# EAGLE design M7050D (EAGLE 6.6.0)
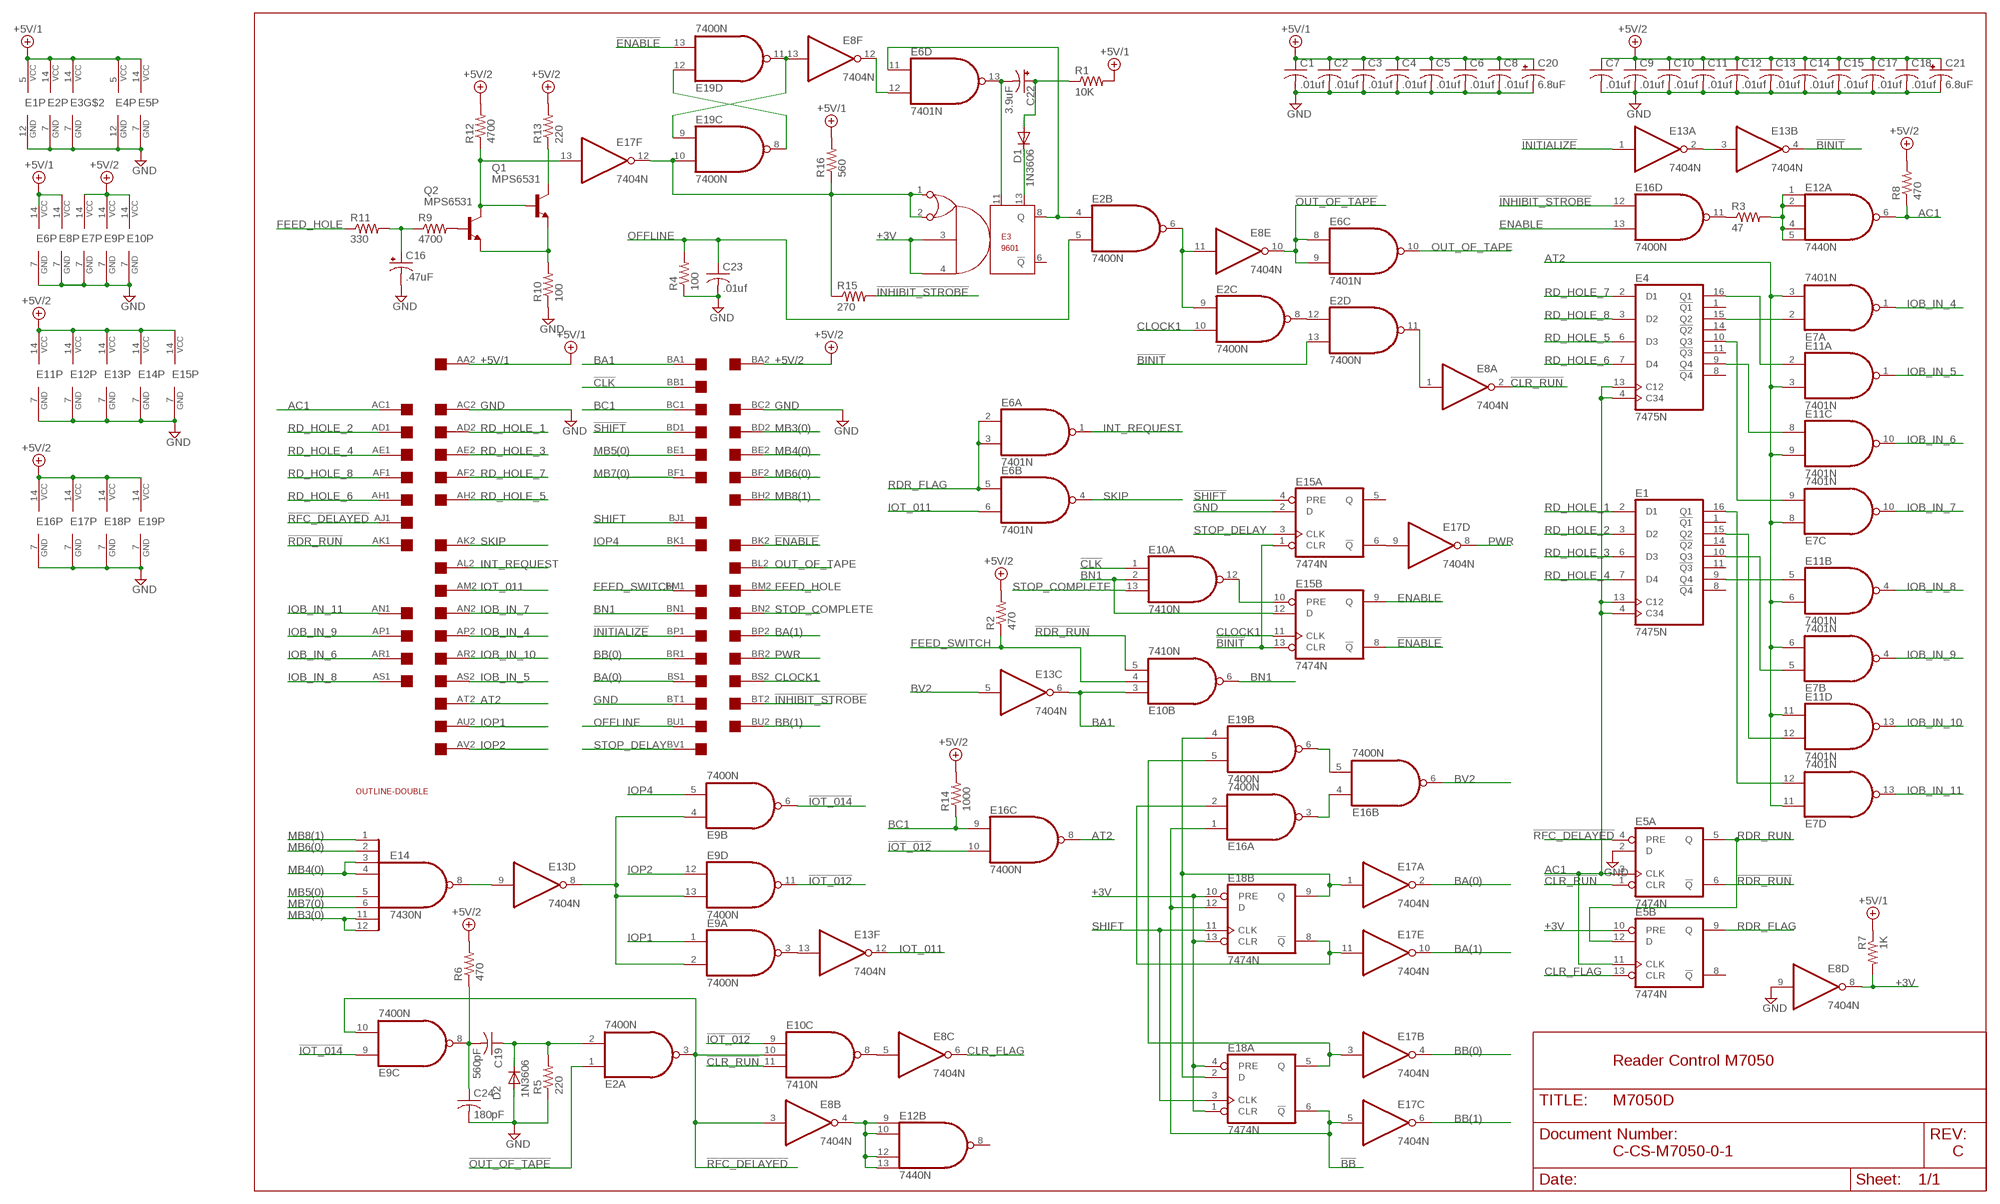
[diagram p0: schematic, sheet 1]

## Parts
C1  .01uf  C-US075-032X103  [C075-032X103]
C2  .01uf  C-US075-032X103  [C075-032X103]
C3  .01uf  C-US075-032X103  [C075-032X103]
C4  .01uf  C-US075-032X103  [C075-032X103]
C5  .01uf  C-US075-032X103  [C075-032X103]
C6  .01uf  C-US075-032X103  [C075-032X103]
C7  .01uf  C-US075-032X103  [C075-032X103]
C8  .01uf  C-US075-032X103  [C075-032X103]
C9  .01uf  C-US075-032X103  [C075-032X103]
C10  .01uf  C-US075-032X103  [C075-032X103]
C11  .01uf  C-US075-032X103  [C075-032X103]
C12  .01uf  C-US075-032X103  [C075-032X103]
C13  .01uf  C-US075-032X103  [C075-032X103]
C14  .01uf  C-US075-032X103  [C075-032X103]
C15  .01uf  C-US075-032X103  [C075-032X103]
C16  .47uF  CPOL-USE15-5AXIAL  [E15-5]
C17  .01uf  C-US075-032X103  [C075-032X103]
C18  .01uf  C-US075-032X103  [C075-032X103]
C19  560pF  C-US075-032X103  [C075-032X103]
C20  6.8uF  CPOL-USE20-8AXIAL  [E12-8]
C21  6.8uF  CPOL-USE20-8AXIAL  [E12-8]
C22  3.9uF  CPOL-USE15-5AXIAL  [E15-5]
C23  .01uf  C-US075-032X103  [C075-032X103]
C24  180pF  C-US075-032X103  [C075-032X103]
D1  1N3606  1N4148DO35-10  [DO35-10]
D2  1N3606  1N4148DO35-10  [DO35-10]
E1  7475N  [DIL16]
E2  7400N  [DIL14]
E3  9601  [DIL14]
E4  7475N  [DIL16]
E5  7474N  74S74N  [DIL14]
E6  7401N  74LS01N  [DIL14]
E7  7401N  74LS01N  [DIL14]
E8  7404N  [DIL14]
E9  7400N  [DIL14]
E10  7410N  [DIL14]
E11  7401N  74LS01N  [DIL14]
E12  7440N  74S20N  [DIL14]
E13  7404N  [DIL14]
E14  7430N  [DIL14]
E15  7474N  74S74N  [DIL14]
E16  7400N  [DIL14]
E17  7404N  [DIL14]
E18  7474N  74S74N  [DIL14]
E19  7400N  [DIL14]
Q1  MPS6531  2N2102  [TO5]
Q2  MPS6531  2N2102  [TO5]
R1  10K  R-US_0207/10  [0207/10]
R2  470  R-US_0207/10  [0207/10]
R3  47  R-US_0207/10  [0207/10]
R4  100  R-US_0207/10  [0207/10]
R5  220  R-US_0207/10  [0207/10]
R6  470  R-US_0207/10  [0207/10]
R7  1K  R-US_0207/10  [0207/10]
R8  470  R-US_0207/10  [0207/10]
R9  4700  R-US_0207/10  [0207/10]
R10  100  R-US_0207/10  [0207/10]
R11  330  R-US_0207/10  [0207/10]
R12  4700  R-US_0207/10  [0207/10]
R13  220  R-US_0207/10  [0207/10]
R14  1000  R-US_0207/10  [0207/10]
R15  270  R-US_0207/10  [0207/10]
R16  560  R-US_0207/10  [0207/10]
U$5  DOUBLE  [EDGE-CON4]
U$6  OUTLINE-DOUBLE  [DOUBLE]

## Nets
!BA: E16.2(A:I1) E17.11(E:I) E18.8(B:!Q)
!BB: E16.1(A:I0) E17.5(C:I) E18.6(A:!Q) E18.12(B:D)
!BINIT: E2.13(D:I1) E13.4(B:O) E15.1(A:CLR) E15.13(B:CLR)
!CLK: E10.1(A:I0) U$5.BB1
!CLR_RUN: E5.1(A:CLR) E8.2(A:O) E10.11(C:I2)
!ENABLE: E15.8(B:!Q) E19.13(D:I1) U$5.BK2
!INHIBIT_STROBE: E16.12(D:I0) R15.2 U$5.BT2
!INITIALIZE: E13.1(A:I) U$5.BP1
!IOT_011: E9.3(A:O) E13.13(F:I)
!IOT_012: E9.11(D:O) E10.9(C:I0) E16.10(C:I1)
!IOT_014: E9.6(B:O) E9.9(C:I0)
!OUT_OF_TAPE: E2.1(A:I0) E6.8(C:I0) E6.9(C:I1) E8.10(E:O)
!RDR_RUN: E5.6(A:!Q) E10.5(B:I2) U$5.AK1
!RFC_DELAYED: E2.3(A:O) E5.4(A:PRE) E8.3(B:I) E9.10(C:I1) E10.10(C:I1) U$5.AJ1
!SHIFT: E15.4(A:PRE) U$5.BD1
+3V: E3.3 E3.4 E5.10(B:PRE) E8.8(D:O) E18.1(A:CLR) E18.4(A:PRE) E18.10(B:PRE) E18.13(B:CLR) R7.2
+5V/1 [Supply]: C1.1 C2.1 C3.1 C4.1 C5.1 C6.1 C8.1 C20.+ E1.5(VCC) E2.14(P:VCC) E3.14(VCC) E4.5(VCC) E5.14(P:VCC) E6.14(P:VCC) E8.14(P:VCC) R1.2 R7.1 R16.2 U$5.AA2
+5V/2 [Supply]: C7.1 C9.1 C10.1 C11.1 C12.1 C13.1 C14.1 C15.1 C17.1 C18.1 C21.+ E7.14(P:VCC) E9.14(P:VCC) E10.14(P:VCC) E11.14(P:VCC) E12.14(P:VCC) E13.14(P:VCC) E14.14(VCC) E15.14(P:VCC) E16.14(P:VCC) E17.14(P:VCC) E18.14(P:VCC) E19.14(P:VCC) R2.2 R6.2 R8.2 R12.2 R13.2 R14.2 U$5.BA2
AC1: E1.4(C34) E1.13(C12) E4.4(C34) E4.13(C12) E5.3(A:CLK) E5.11(B:CLK) E12.6(A:O) R8.1 U$5.AC1
AT2: E7.3(A:I1) E7.6(B:I1) E7.8(C:I0) E7.11(D:I0) E11.3(A:I1) E11.6(B:I1) E11.9(C:I1) E11.11(D:I0) E16.8(C:O) U$5.AT2
BA: E17.1(A:I) E18.2(A:D) E18.9(B:Q) E19.4(B:I0)
BA1: E10.3(B:I0) E13.6(C:O) U$5.BA1
BA(0): E17.2(A:O) U$5.BS1
BA(1): E17.10(E:O) U$5.BP2
BB: E17.3(B:I) E18.5(A:Q) E19.5(B:I1)
BB(0): E17.4(B:O) U$5.BR1
BB(1): E17.6(C:O) U$5.BU2
BC1: E16.9(C:I0) R14.1 U$5.BC1
BN1: E10.2(A:I1) E10.6(B:O) E15.12(B:D) U$5.BN1
BV2: E13.5(C:I) E16.6(B:O)
CLOCK1: E2.10(C:I1) E15.11(B:CLK) U$5.BS2
CLR_FLAG: E5.13(B:CLR) E8.6(C:O)
ENABLE: E15.9(B:Q) E16.13(D:I1)
FEED_HOLE: R11.1 U$5.BM2
FEED_SWITCH: E10.4(B:I1) R2.1 U$5.BM1
GND [Supply]: C1.2 C2.2 C3.2 C4.2 C5.2 C6.2 C7.2 C8.2 C9.2 C10.2 C11.2 C12.2 C13.2 C14.2 C15.2 C16.- C17.2 C18.2 C20.- C21.- C23.2 C24.2 D2.A E1.12(GND) E2.7(P:GND) E3.7(GND) E4.12(GND) E5.2(A:D) E5.7(P:GND) E6.7(P:GND) E7.7(P:GND) E8.7(P:GND) E8.9(D:I) E9.7(P:GND) E10.7(P:GND) E11.7(P:GND) E12.7(P:GND) E13.7(P:GND) E14.7(GND) E15.2(A:D) E15.7(P:GND) E16.7(P:GND) E17.7(P:GND) E18.7(P:GND) E19.7(P:GND) R4.1 R5.1 R10.1 U$5.AC2 U$5.BC2 U$5.BT1
INT_REQUEST: E6.1(A:O) U$5.AL2
IOB_IN_4: E7.1(A:O) U$5.AP2
IOB_IN_5: E11.1(A:O) U$5.AS2
IOB_IN_6: E11.10(C:O) U$5.AR1
IOB_IN_7: E7.10(C:O) U$5.AN2
IOB_IN_8: E11.4(B:O) U$5.AS1
IOB_IN_9: E7.4(B:O) U$5.AP1
IOB_IN_10: E11.13(D:O) U$5.AR2
IOB_IN_11: E7.13(D:O) U$5.AN1
IOP1: E9.1(A:I0) U$5.AU2
IOP2: E9.12(D:I0) U$5.AV2
IOP4: E9.5(B:I1) U$5.BK1
IOT_011: E6.6(B:I1) E13.12(F:O) U$5.AM2
MB3(0): E14.11(I6) E14.12(I7) U$5.BD2
MB4(0): E14.3(I2) E14.4(I3) U$5.BE2
MB5(0): E14.5(I4) U$5.BE1
MB6(0): E14.2(I1) U$5.BF2
MB7(0): E14.6(I5) U$5.BF1
MB8(1): E14.1(I0) U$5.BH2
N$1: D1.C E3.13
N$2: E4.15(Q2) E7.2(A:I0)
N$3: E4.16(Q1) E11.2(A:I0)
N$4: C22.+ D1.A R1.1
N$5: E13.9(D:I) E14.8(O)
N$6: E2.11(D:O) E8.1(A:I)
N$8: E9.2(A:I1) E9.4(B:I0) E9.13(D:I1) E13.8(D:O)
N$9: E4.9(Q4) E11.8(C:I0)
N$10: E4.10(Q3) E7.9(C:I1)
N$11: E1.9(Q4) E11.5(B:I0)
N$12: E1.10(Q3) E7.5(B:I0)
N$13: E1.15(Q2) E11.12(D:I1)
N$14: E1.16(Q1) E7.12(D:I1)
N$16: E2.8(C:O) E2.12(D:I0)
N$17: E17.13(F:I) Q1.2(B) Q2.3(C) R12.1
N$18: Q1.3(C) R13.1
N$19: Q1.1(E) Q2.1(E) R10.2
N$20: Q2.2(B) R9.2
N$21: E3.1 E3.2 E17.12(F:O) E19.10(C:I1) R15.1 R16.1
N$22: C16.+ R9.1 R11.2
N$24: E16.5(B:I1) E19.6(B:O)
N$25: E16.3(A:O) E16.4(B:I0)
N$26: E16.11(D:O) R3.1
N$27: E15.6(A:!Q) E17.9(D:I)
N$28: E10.12(A:O) E15.10(B:PRE)
N$29: C19.2 C24.1 E9.8(C:O) R6.1
N$30: C19.1 D2.C E2.2(A:I1) R5.2
N$32: E13.2(A:O) E13.3(B:I)
N$33: E8.5(C:I) E10.8(C:O)
N$34: E2.4(B:I0) E3.8(Q) E6.11(D:I0)
N$35: E2.6(B:O) E2.9(C:I0) E8.11(E:I)
N$36: E8.4(B:O) E12.9(B:I0) E12.10(B:I1) E12.12(B:I2) E12.13(B:I3)
N$37: C22.- E3.11 E6.13(D:O)
N$38: E6.12(D:I1) E8.12(F:O)
N$39: E12.1(A:I0) E12.2(A:I1) E12.4(A:I2) E12.5(A:I3) R3.2
N$40: E8.13(F:I) E19.9(C:I0) E19.11(D:O)
N$41: E19.8(C:O) E19.12(D:I0)
OFFLINE: C23.1 E2.5(B:I1) R4.2 U$5.BU1
OUT_OF_TAPE: E6.10(C:O) U$5.BL2
PWR: E17.8(D:O) U$5.BR2
RD_HOLE_1: E1.2(D1) U$5.AD2
RD_HOLE_2: E1.3(D2) U$5.AD1
RD_HOLE_3: E1.6(D3) U$5.AE2
RD_HOLE_4: E1.7(D4) U$5.AE1
RD_HOLE_5: E4.6(D3) U$5.AH2
RD_HOLE_6: E4.7(D4) U$5.AH1
RD_HOLE_7: E4.2(D1) U$5.AF2
RD_HOLE_8: E4.3(D2) U$5.AF1
RDR_FLAG: E5.9(B:Q) E6.2(A:I0) E6.3(A:I1) E6.5(B:I0)
RDR_RUN: E5.5(A:Q) E5.12(B:D)
SHIFT: E18.3(A:CLK) E18.11(B:CLK) U$5.BJ1
SKIP: E6.4(B:O) U$5.AK2
STOP_COMPLETE: E10.13(A:I2) U$5.BN2
STOP_DELAY: E15.3(A:CLK) U$5.BV1
Unconnected: E1.1(!Q1) E1.8(!Q4) E1.11(!Q3) E1.14(!Q2) E3.6(!Q) E4.1(!Q1) E4.8(!Q4) E4.11(!Q3) E4.14(!Q2) E5.8(B:!Q) E12.8(B:O) E13.10(E:O) E13.11(E:I) E15.5(A:Q) E19.1(A:I0) E19.2(A:I1) E19.3(A:O) U$5.AA1 U$5.AB1 U$5.AB2 U$5.AJ2 U$5.AL1 U$5.AM1 U$5.AT1 U$5.AU1 U$5.AV1 U$5.BB2 U$5.BH1 U$5.BJ2 U$5.BL1 U$5.BV2

## Notes on the sheet
- Reader Control M7050
- C-CS-M7050-0-1 | C

## Library data of the parts
C1-C15 C17-C19 C23 C24 = rcl:C-US: CAPACITOR, American symbol
C16 C22 = dec-con:CPOL-USE15-5AXIAL: 0.5" veresion of an electrolytic
C20 C21 = dec-con:CPOL-USE20-8AXIAL: A 0.8 inch electrolytic.
D1 D2 = diode:1N4148: DIODE high speed (Philips)
E1 E4 = 74xx-us:74*75: 4-bit bistable LATCH
E2 E9 E16 E19 = 74xx-us:74*00: Quad 2-input NAND gate
E3 = dec-con:9601: DEC9601 monstable
E5 E15 E18 = 74xx-us:74*74: Dual D type positive edge triggered FLIP FLOP, preset and clear
E6 E7 E11 = 74xx-us:74*01: Quad 2-input NAND gate, open collector
E8 E13 E17 = 74xx-us:74*04: Hex INVERTER
E10 = 74xx-us:74*10: Triple 3-input NAND gate
E12 = 74xx-us:74*20: Dual 4-input NAND gate
E14 = 74xx-us:74*30: 8-input NAND gate
Q1 Q2 = transistor-npn:2N2102: NPN Transistor
R1-R16 = rcl:R-US_: RESISTOR, American symbol
U$5 = dec-con:DOUBLE: Double-Height DEC board
U$6 = dec-con:OUTLINE-*: Board outlines for DEC boards.

## Net classes
1 Supply: width 0.813 mm

## Board
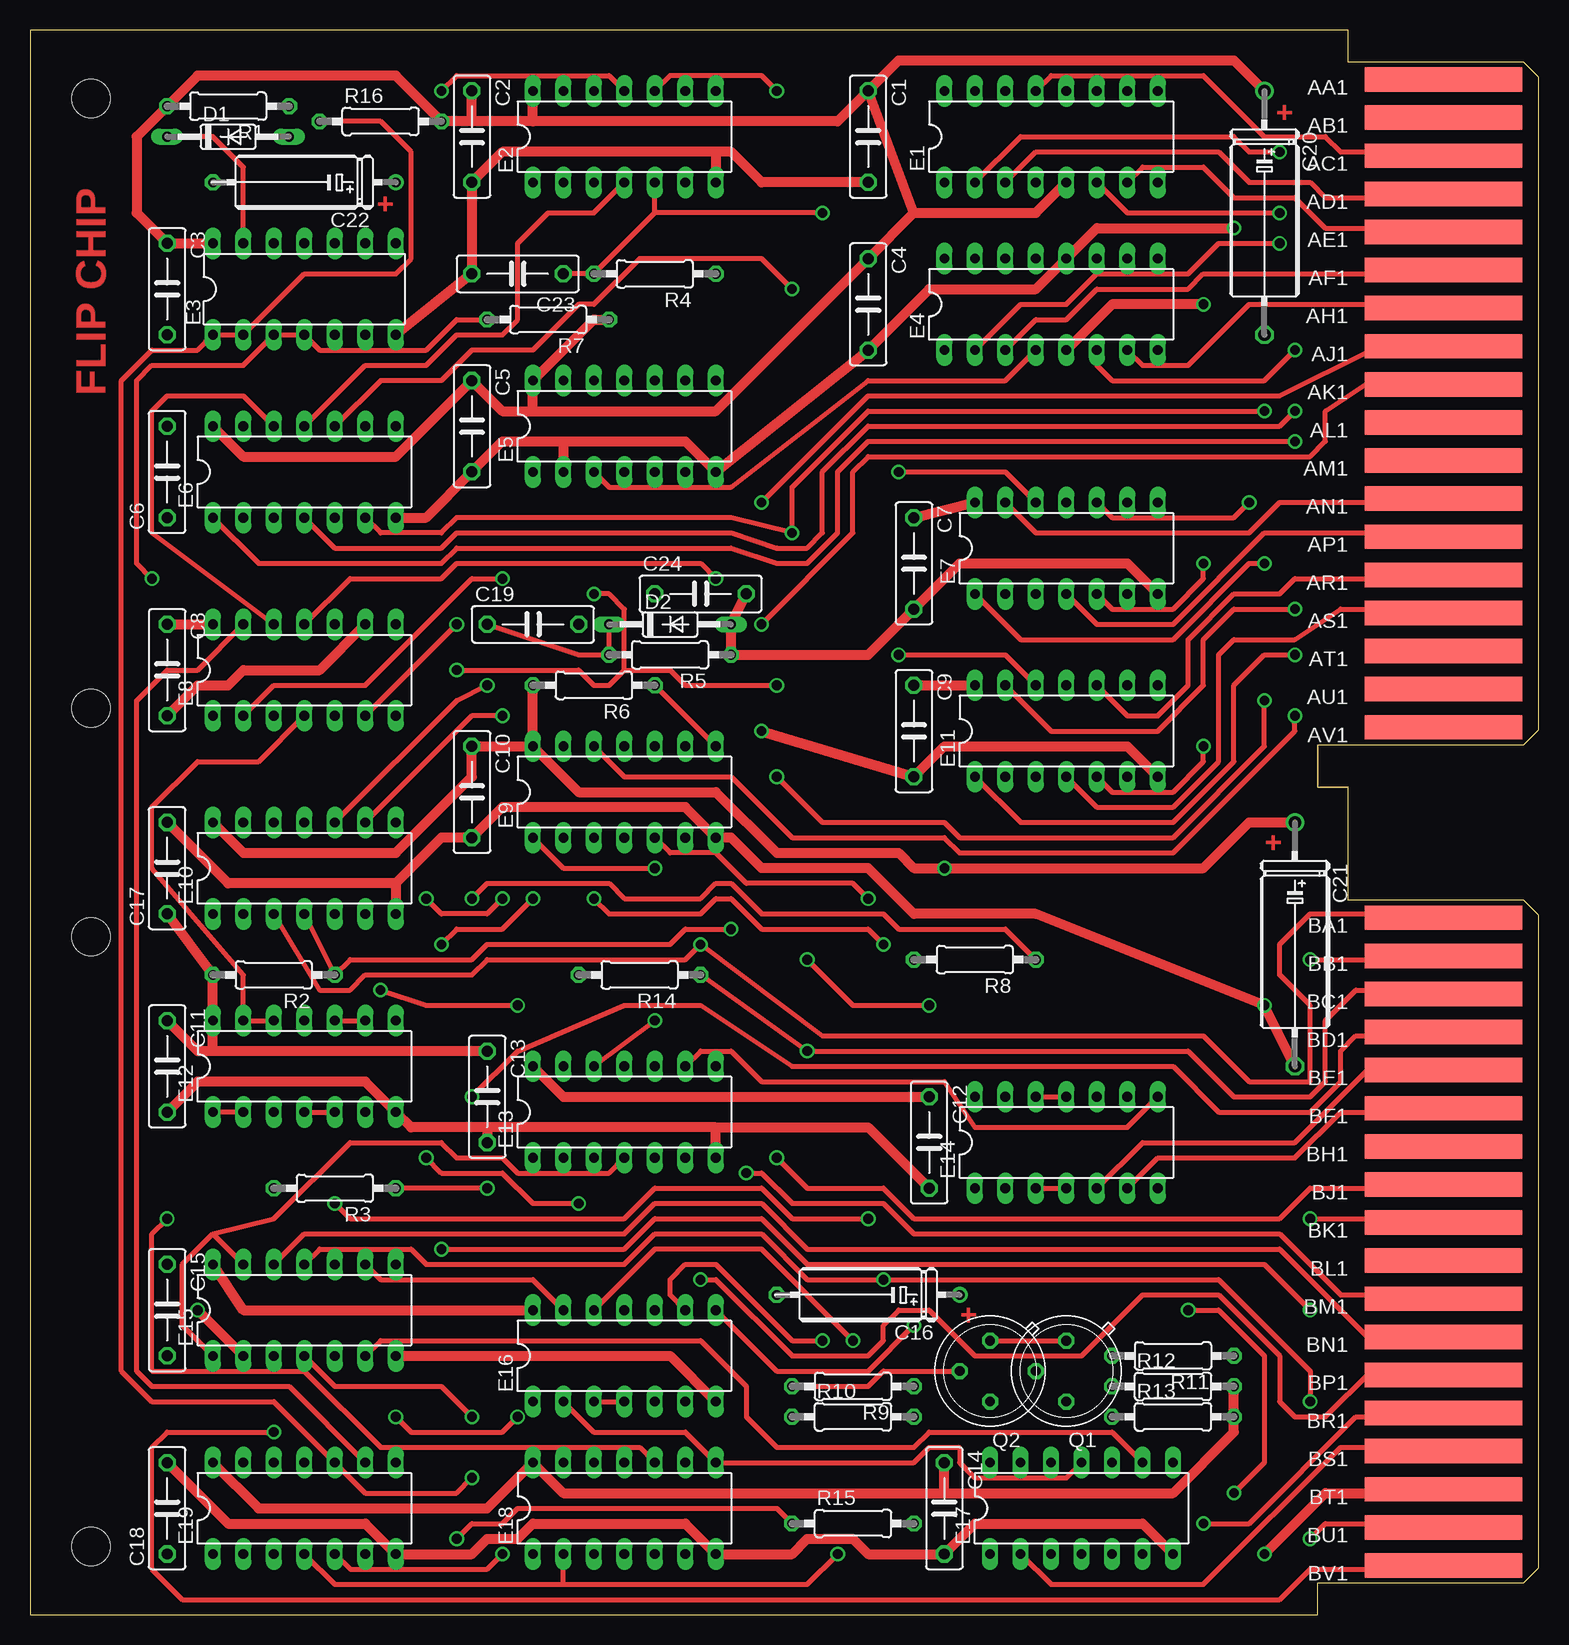
[diagram p1: board, top side]
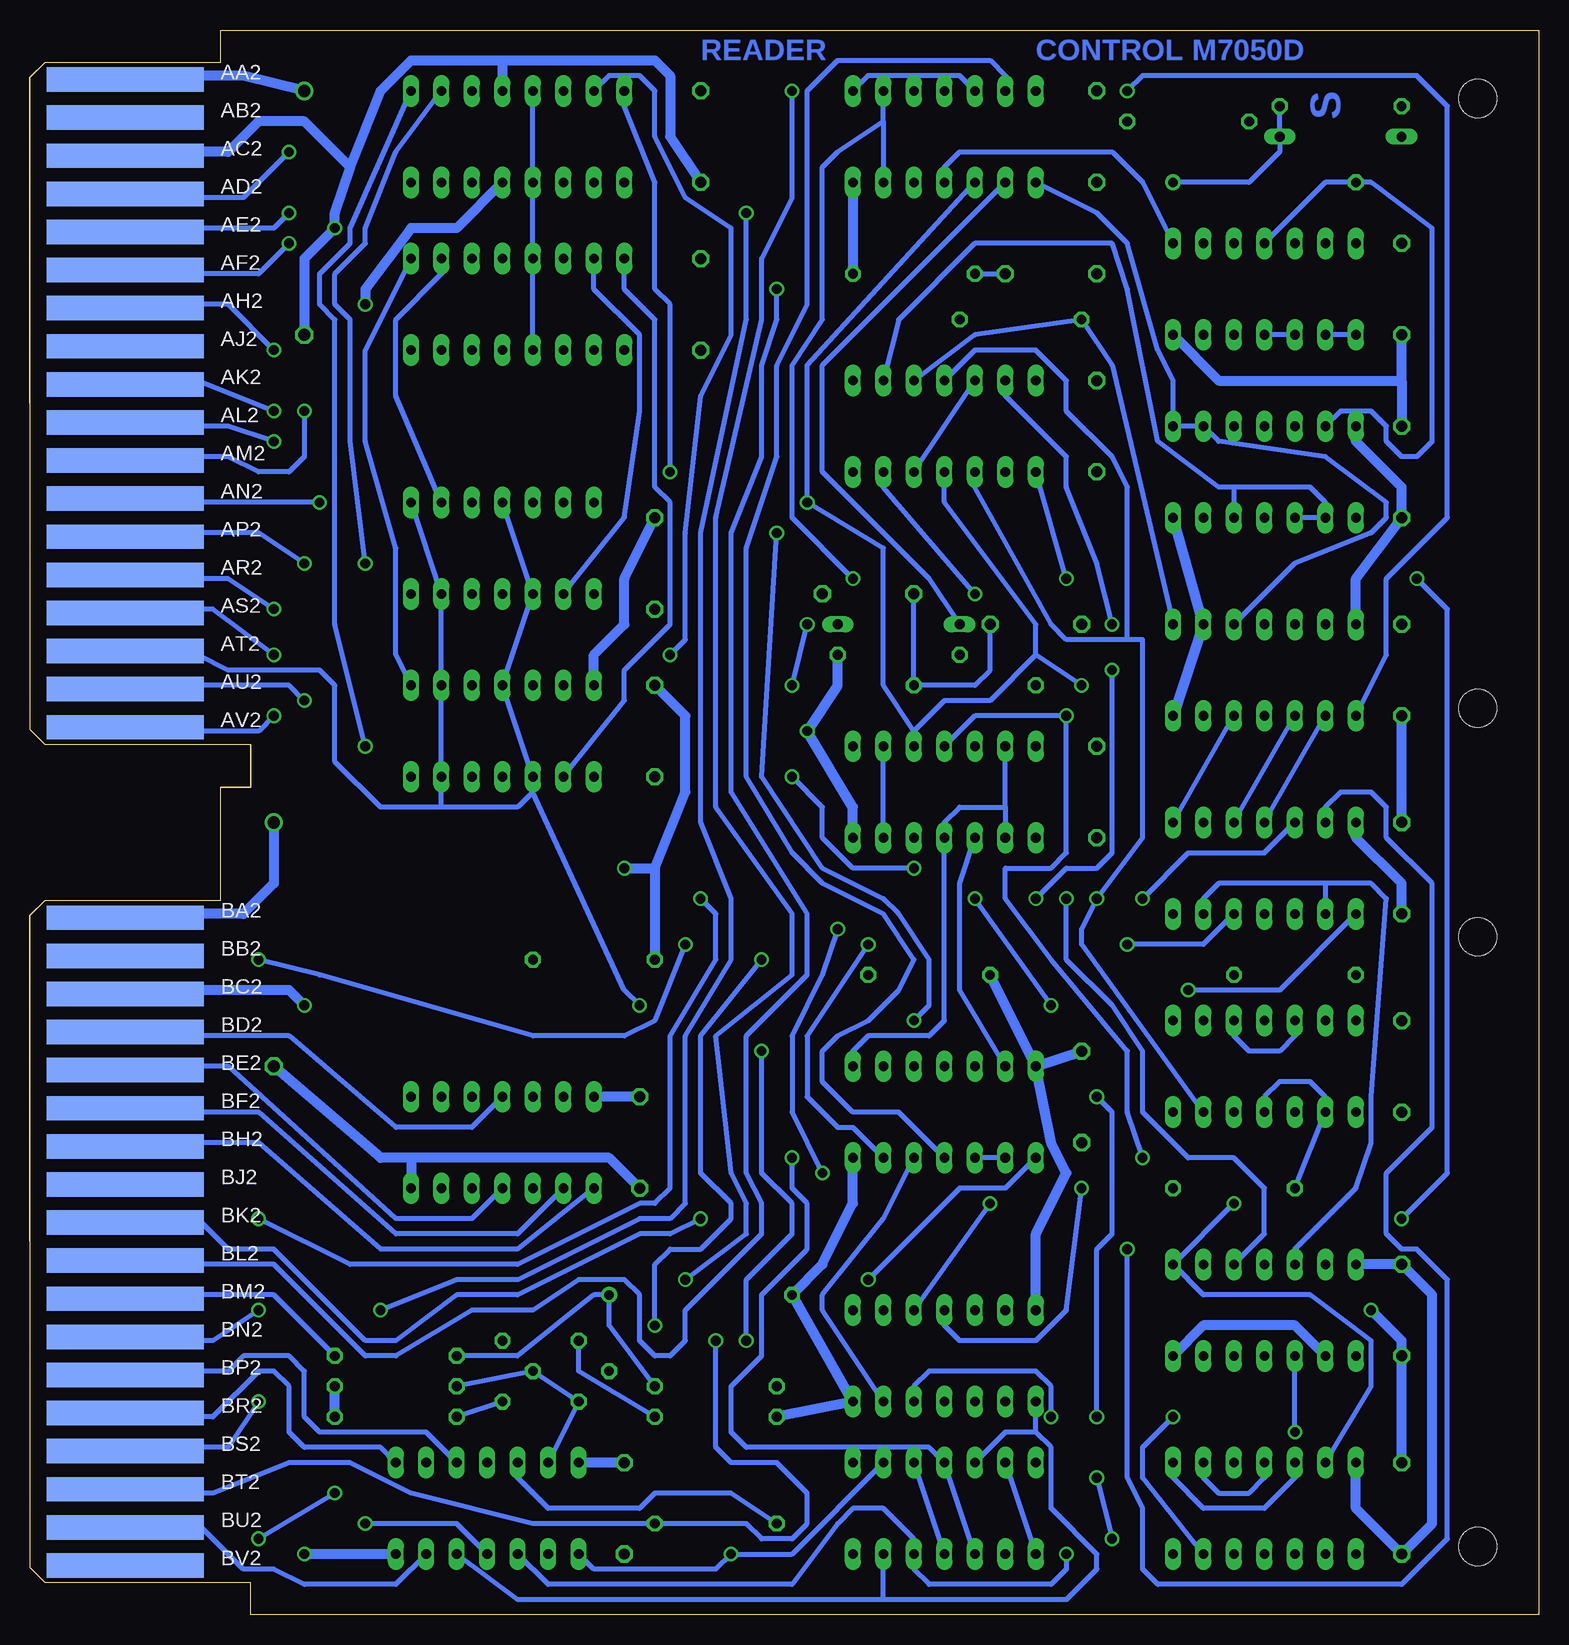
[diagram p2: board, bottom side, seen from below]

Size 125.73 x 132.08 mm. Coordinates in mm from the lower left corner, seen from the top.
Copper layers (1+16): Top 0.035mm / dielectric 1.5mm / Bottom 0.035mm
Design rules "16mils": minimum track width 16mil, minimum drill 32mil, track to track 15mil, track to pad 10mil, pad to pad 10mil, via to via 10mil, smd to smd 10mil, copper to edge 13mil, drill to drill 10mil, minimum pad ring 10mil, minimum via ring 8mil, stop-mask expansion 0mil, vias tented up to drill 0mil, thermal gap 10mil

### Footprints (pad centres in the part's own frame; a part is rotated, then mirrored left to right if it is on the bottom)
C075-032X103 = drill 0.914 octagon: 1 -3.81,0; 2 3.81,0
E15-5 = drill 0.813: + -7.62,0 | drill 0.813 octagon: - 7.62,0
E12-8 = drill 1.016: + -10.16,0 | drill 1.016 octagon: - 10.16,0
DO35-10 = drill 0.813 long: A 5.08,0; C -5.08,0
DIL16 = drill 0.813 long: 1 -8.89,-3.81; 2 -6.35,-3.81; 3 -3.81,-3.81; 4 -1.27,-3.81; 5 1.27,-3.81; 6 3.81,-3.81; 7 6.35,-3.81; 8 8.89,-3.81; 9 8.89,3.81; 10 6.35,3.81; 11 3.81,3.81; 12 1.27,3.81; 13 -1.27,3.81; 14 -3.81,3.81; 15 -6.35,3.81; 16 -8.89,3.81
DIL14 = drill 0.813 long: 1 -7.62,-3.81; 2 -5.08,-3.81; 3 -2.54,-3.81; 4 0,-3.81; 5 2.54,-3.81; 6 5.08,-3.81; 7 7.62,-3.81; 8 7.62,3.81; 9 5.08,3.81; 10 2.54,3.81; 11 0,3.81; 12 -2.54,3.81; 13 -5.08,3.81; 14 -7.62,3.81
TO5 = drill 0.813 octagon: 1 0,-2.54; 2 2.54,0; 3 0,2.54
0207/10 = drill 0.813 octagon: 1 -5.08,0; 2 5.08,0
EDGE-CON4 = smd 13.106 x 2.032: AA1 7.938,4.128; AB1 7.938,7.303; AC1 7.938,10.477; AD1 7.938,13.652; AE1 7.938,16.828; AF1 7.938,20.003; AH1 7.938,23.177; AJ1 7.938,26.352; AK1 7.938,29.527; AL1 7.938,32.703; AM1 7.938,35.877; AN1 7.938,39.053; AP1 7.938,42.227; AR1 7.938,45.403; AS1 7.938,48.578; AT1 7.938,51.752; AU1 7.938,54.928; AV1 7.938,58.102; BA1 7.938,73.978; BB1 7.938,77.153; BC1 7.938,80.328; BD1 7.938,83.502; BE1 7.938,86.677; BF1 7.938,89.853; BH1 7.938,93.028; BJ1 7.938,96.203; BK1 7.938,99.377; BL1 7.938,102.552; BM1 7.938,105.728; BN1 7.938,108.903; BP1 7.938,112.078; BR1 7.938,115.252; BS1 7.938,118.427; BT1 7.938,121.603; BU1 7.938,124.778; BV1 7.938,127.953 | smd 13.106 x 2.032 bottom: AA2 7.938,4.128; AB2 7.938,7.303; AC2 7.938,10.477; AD2 7.938,13.652; AE2 7.938,16.828; AF2 7.938,20.003; AH2 7.938,23.177; AJ2 7.938,26.352; AK2 7.938,29.527; AL2 7.938,32.703; AM2 7.938,35.877; AN2 7.938,39.053; AP2 7.938,42.227; AR2 7.938,45.403; AS2 7.938,48.578; AT2 7.938,51.752; AU2 7.938,54.928; AV2 7.938,58.102; BA2 7.938,73.978; BB2 7.938,77.153; BC2 7.938,80.328; BD2 7.938,83.502; BE2 7.938,86.677; BF2 7.938,89.853; BH2 7.938,93.028; BJ2 7.938,96.203; BK2 7.938,99.377; BL2 7.938,102.552; BM2 7.938,105.728; BN2 7.938,108.903; BP2 7.938,112.078; BR2 7.938,115.252; BS2 7.938,118.427; BT2 7.938,121.603; BU2 7.938,124.778; BV2 7.938,127.953
DOUBLE = hole 3.175: 120.65,56.515; 120.65,5.715; 120.65,75.565; 120.65,126.365

### Placement (x,y rotation side)
C1  69.85,123.19 270 top
C2  36.83,123.19 270 top
C3  11.43,110.49 270 top
C4  69.85,109.22 270 top
C5  36.83,99.06 270 top
C6  11.43,95.25 90 top
C7  73.66,87.63 270 top
C8  11.43,78.74 270 top
C9  73.66,73.66 270 top
C10  36.83,68.58 270 top
C11  11.43,45.72 270 top
C12  74.93,39.37 270 top
C13  38.1,43.18 270 top
C14  76.2,8.89 270 top
C15  11.43,25.4 270 top
C16  69.85,26.67 180 top
C17  11.43,62.23 90 top
C18  11.43,8.89 90 top
C19  41.91,82.55 0 top
C20  102.87,116.84 270 top
C21  105.41,55.88 270 top
C22  22.86,119.38 180 top
C23  40.64,111.76 180 top
C24  55.88,85.09 0 top
D1  16.51,123.19 0 top
D2  53.34,82.55 0 top
E1  85.09,123.19 0 top
E2  49.53,123.19 0 top
E3  22.86,110.49 0 top
E4  85.09,109.22 0 top
E5  49.53,99.06 0 top
E6  22.86,95.25 0 top
E7  86.36,88.9 0 top
E8  22.86,78.74 0 top
E9  49.53,68.58 0 top
E10  22.86,62.23 0 top
E11  86.36,73.66 0 top
E12  22.86,45.72 0 top
E13  49.53,41.91 0 top
E14  86.36,39.37 0 top
E15  22.86,25.4 0 top
E16  49.53,21.59 0 top
E17  87.63,8.89 0 top
E18  49.53,8.89 0 top
E19  22.86,8.89 0 top
Q1  86.36,20.32 180 top
Q2  80.01,20.32 180 top
R1  16.51,125.73 180 top
R2  20.32,53.34 180 top
R3  25.4,35.56 180 top
R4  52.07,111.76 180 top
R5  53.34,80.01 180 top
R6  46.99,77.47 180 top
R7  43.18,107.95 180 top
R8  78.74,54.61 180 top
R9  68.58,19.05 180 top
R10  68.58,16.51 0 top
R11  95.25,21.59 180 top
R12  95.25,19.05 0 top
R13  95.25,16.51 0 top
R14  50.8,53.34 180 top
R15  68.58,7.62 0 top
R16  29.21,124.46 0 top
U$3  [FLIPCHIP]  1.27,82.55 0 top
U$5  125.73,132.08 180 top
U$6  125.73,132.08 180 top

### Tracks (layer width: path | path; a pad name or v marks a point on that pad's centre or on a via)
!BA
  Top 0.406: E17.11 86.36,11.43 78.74,11.43 77.47,12.7 77.47,13.97 74.93,13.97 73.66,12.7 E18.8 54.61,15.24 46.99,15.24 E16.2
!BB
  Bottom 0.406: E17.5 85.09,1.27 54.61,1.27 | 54.61,1.27 E18.6 | 41.91,15.24 E16.1 | 41.91,15.24 40.64,13.97 40.64,8.89 36.83,5.08 36.83,3.81 39.37,1.27 54.61,1.27 | E18.12 44.45,15.24 41.91,15.24
!BINIT
  Top 0.406: E15.1 12.7,24.13 12.7,29.21 15.24,31.75 | 15.24,31.75 E15.13 | E13.4 48.26,36.83 40.64,36.83 39.37,38.1 35.56,38.1 34.29,39.37 26.67,39.37 20.32,33.02 15.24,31.75
  Bottom 0.406: E2.13 44.45,128.27 45.72,129.54 58.42,129.54 60.96,127 60.96,109.22 63.5,104.14 63.5,96.52 66.04,88.9 66.04,69.85 62.23,63.5 59.69,60.96 54.61,58.42 52.07,54.61 53.34,52.07 55.88,49.53 58.42,48.26 59.69,46.99 59.69,44.45 57.15,41.91 53.34,41.91 E13.4
!CLK  (via drill 0.81)
  Top 0.406: U$5.BB1 116.84,54.61 v106.68,54.61 | v71.12,55.88 69.85,57.15 60.96,57.15 58.42,59.69 57.15,59.69 55.88,58.42 48.26,58.42 v46.99,59.69 | v40.64,50.8 33.02,50.8 v29.21,52.07
  Bottom 0.406: E10.1 21.59,52.07 v29.21,52.07 | v106.68,54.61 101.6,53.34 83.82,48.26 76.2,48.26 73.66,49.53 v71.12,55.88 | v40.64,50.8 v46.99,59.69
!CLR_RUN  (via drill 0.81)
  Top 0.406: v39.37,86.36 36.83,86.36 27.94,77.47 20.32,77.47 E8.2
  Bottom 0.406: E10.11 E8.2 | v39.37,86.36 E5.1
!ENABLE  (via drill 0.81)
  Top 0.406: v25.4,34.29 26.67,33.02 49.53,33.02 52.07,35.56 60.96,35.56 63.5,33.02 v69.85,33.02
  Bottom 0.406: v25.4,34.29 E15.8 27.94,26.67 19.05,26.67 13.97,22.86 13.97,19.05 E19.13 | v69.85,33.02 72.39,31.75 74.93,31.75 85.09,26.67 90.17,26.67 95.25,22.86 97.79,22.86 105.41,30.48 109.22,30.48 111.76,33.02 116.84,33.02 U$5.BK2
!INHIBIT_STROBE  (via drill 0.81)
  Top 0.406: E16.12 52.07,30.48 60.96,30.48 v68.58,22.86
  Bottom 0.406: U$5.BT2 116.84,10.16 110.49,10.16 104.14,12.7 99.06,12.7 93.98,10.16 83.82,7.62 R15.2 66.04,7.62 64.77,6.35 62.23,6.35 60.96,7.62 60.96,10.16 63.5,12.7 67.31,12.7 68.58,13.97 v68.58,22.86
!INITIALIZE  (via drill 0.81)
  Top 0.406: v55.88,27.94 57.15,27.94 63.5,21.59 69.85,21.59 71.12,22.86 71.12,24.13 72.39,25.4 74.93,25.4 78.74,21.59 87.63,21.59 92.71,26.67 99.06,26.67 104.14,21.59 104.14,17.78 105.41,16.51 107.95,16.51 111.76,20.32 116.84,20.32 U$5.BP1
  Bottom 0.406: E13.1 44.45,35.56 48.26,35.56 v55.88,27.94
!IOT_011
  Bottom 0.406: E13.13 48.26,52.07 48.26,60.96 E9.3
!IOT_012  (via drill 0.81)
  Top 0.406: v45.72,34.29 41.91,34.29 39.37,36.83 34.29,36.83 v33.02,38.1 | E10.9 36.83,74.93 v39.37,74.93
  Bottom 0.406: v45.72,34.29 E16.10 | v33.02,38.1 34.29,41.91 34.29,46.99 40.64,54.61 44.45,59.69 44.45,62.23 40.64,62.23 39.37,63.5 v39.37,74.93 46.99,74.93 E9.11
!IOT_014
  Bottom 0.406: E9.6 E9.9
!OUT_OF_TAPE
  Bottom 0.406: E8.10 20.32,87.63 13.97,90.17 12.7,91.44 12.7,92.71 17.78,96.52 26.67,97.79 E6.9 E6.8 30.48,102.87 31.75,105.41 34.29,114.3 36.83,116.84 E2.1
!RDR_RUN  (via drill 0.81)
  Top 0.406: U$5.AK1 116.84,102.87 111.76,102.87 107.95,100.33 107.95,97.79 106.68,96.52 69.85,96.52 68.58,95.25 68.58,90.17 v60.96,82.55 | v34.29,55.88 35.56,57.15 39.37,57.15 v41.91,59.69 | v46.99,85.09 48.26,85.09 49.53,83.82 49.53,78.74 | 49.53,78.74 48.26,77.47 46.99,77.47 45.72,78.74 v35.56,78.74 | 49.53,78.74 53.34,78.74 54.61,77.47 v62.23,77.47
  Bottom 0.406: v62.23,77.47 v60.96,82.55 | E10.5 27.94,55.88 v34.29,55.88 | E5.6 54.61,93.98 v46.99,85.09 | v41.91,59.69 39.37,62.23 36.83,62.23 35.56,63.5 v35.56,78.74
!RFC_DELAYED  (via drill 0.81)
  Top 0.406: U$5.AJ1 116.84,105.41 111.76,105.41 104.14,101.6 69.85,101.6 v60.96,92.71 | E10.10 35.56,76.2 v38.1,77.47
  Bottom 0.406: E10.10 E8.3 | 52.07,73.66 E9.10 | 52.07,73.66 54.61,77.47 54.61,88.9 v60.96,92.71 60.96,104.14 E2.3 | E5.4 49.53,92.71 41.91,82.55 41.91,80.01 | v38.1,77.47 41.91,80.01 | 41.91,80.01 45.72,76.2 49.53,76.2 52.07,73.66
!SHIFT  (via drill 0.81)
  Top 0.406: U$5.BD1 117.14,48.56 116.84,48.26 110.49,48.26 109.22,46.99 109.22,44.45 106.68,41.91 99.06,41.91 95.25,45.72 63.5,45.72 55.88,50.8 49.53,50.8 40.64,46.99 v36.83,43.18 | E15.4 25.4,19.05 34.29,19.05 v36.83,16.51
  Bottom 0.406: v36.83,43.18 35.56,41.91 35.56,31.75 36.83,30.48 v36.83,16.51
+3V  (via drill 0.81)
  Top 0.406: R7.2 35.56,107.95 33.02,105.41 24.13,105.41 E3.4 E3.3 17.78,104.14 10.16,104.14 8.89,102.87 8.89,87.63 v10.16,86.36 | E18.10 50.8,13.97 44.45,13.97 | 44.45,13.97 E18.13 | 44.45,13.97 29.21,13.97 22.86,20.32 10.16,20.32 10.16,31.75 v11.43,33.02
  Bottom 0.406: E18.10 E18.4 | E18.13 E18.1 | E8.8 35.56,104.14 R7.2 46.99,106.68 E5.10 | E3.3 E3.4 | v11.43,33.02 7.62,36.83 7.62,83.82 v10.16,86.36
+5V/1  (via drill 0.81)
  Top 0.813: 36.83,124.46 R16.2 30.48,128.27 13.97,128.27 R1.2 8.89,123.19 8.89,116.84 C3.1 E3.14 | 36.83,124.46 C2.1 | C1.1 67.31,124.46 41.91,124.46 | 41.91,124.46 36.83,124.46 | 73.66,116.84 C4.1 57.15,100.33 41.91,100.33 | 73.66,116.84 C1.1 | 73.66,116.84 83.82,116.84 E1.5 | 41.91,124.46 E2.14 | C20.+ 100.33,129.54 72.39,129.54 C1.1 | 41.91,100.33 39.37,100.33 C5.1 30.48,96.52 17.78,96.52 E6.14 | R7.1 46.99,107.95 E5.14 41.91,100.33 | E4.5 90.17,109.22 v97.79,109.22 | C8.1 E8.14
  Bottom 0.813: E6.14 15.24,97.79 11.43,93.98 C6.1 15.24,86.36 E8.14 | U$5.AA2 117.24,127.87 116.84,128.27 107.95,128.27 C20.+ | E1.5 90.17,115.57 93.98,115.57 97.79,110.49 v97.79,109.22
+5V/2  (via drill 0.81)
  Top 0.813: E19.14 19.05,8.89 38.1,8.89 E18.14 44.45,10.16 76.2,10.16 | E16.14 17.78,25.4 E15.14 | R12.2 R13.2 100.33,15.24 95.25,10.16 76.2,10.16 | 76.2,10.16 C14.1 | C17.1 R2.2 E12.14 15.24,46.99 | C11.1 13.97,46.99 15.24,46.99 | C13.1 15.24,46.99 | C21.+ 101.6,66.04 97.79,62.23 v76.2,62.23 73.66,62.23 72.39,63.5 62.23,63.5 57.15,68.58 45.72,68.58 E9.14 | C9.1 E11.14 | E9.14 R6.2 | E9.14 C10.1 36.83,69.85 30.48,63.5 17.78,63.5 E10.14 | C7.1 E7.14 | C12.1 44.45,43.18 E13.14
  Bottom 0.813: E19.14 15.24,8.89 C18.1 8.89,7.62 8.89,26.67 C15.1 E15.14 | U$5.BA2 117.24,58.02 116.84,58.42 107.95,58.42 105.41,60.96 C21.+ | C12.1 E14.14 | R13.2 R12.2 | E13.14 C13.1 | E13.14 R14.2 | E13.14 40.64,39.37 39.37,36.83 41.91,31.75 E16.14 | C14.1 E17.14 | v76.2,62.23 73.66,62.23 | 73.66,62.23 R8.2 | C9.1 71.12,74.93 71.12,68.58 73.66,62.23 | C17.1 11.43,60.96 15.24,64.77 E10.14 | C7.1 76.2,86.36 76.2,82.55 78.74,80.01 E11.14
AC1  (via drill 0.81)
  Top 0.406: R8.1 81.28,57.15 72.39,57.15 71.12,58.42 60.96,58.42 58.42,60.96 57.15,60.96 55.88,59.69 49.53,59.69 48.26,60.96 38.1,60.96 v36.83,59.69 | E4.4 81.28,102.87 69.85,102.87 58.42,93.98 48.26,93.98 E5.3 | U$5.AC1 116.84,121.92 109.22,121.92 107.95,123.19 102.87,123.19 97.79,128.27 85.09,128.27 E1.13
  Bottom 0.406: E12.6 38.1,55.88 38.1,57.15 v36.83,59.69 33.02,64.77 33.02,81.28 34.29,81.28 | 34.29,81.28 39.37,81.28 40.64,82.55 46.99,93.98 E5.3 | E4.4 E4.13 E1.4 E1.13 | E5.11 46.99,105.41 41.91,105.41 39.37,102.87 39.37,100.33 35.56,96.52 34.29,93.98 34.29,81.28
AT2  (via drill 0.81)
  Top 0.406: v74.93,50.8 68.58,50.8 v64.77,54.61 | E16.8 62.23,20.32 69.85,20.32 v73.66,24.13
  Bottom 0.406: 83.82,68.58 E11.3 E11.11 E7.3 E7.11 | 83.82,68.58 85.09,67.31 91.44,67.31 | 91.44,67.31 E11.6 E11.9 E7.6 E7.8 | 91.44,67.31 96.52,67.31 100.33,71.12 100.33,77.47 101.6,78.74 109.22,78.74 111.76,80.01 116.84,80.01 U$5.AT2 | 83.82,68.58 76.2,52.07 v74.93,50.8 | v64.77,54.61 69.85,48.26 69.85,36.83 67.31,34.29 67.31,33.02 69.85,30.48 72.39,30.48 73.66,29.21 v73.66,24.13
BA  (via drill 0.81)
  Top 0.406: E19.4 25.4,2.54 44.45,2.54 | 44.45,2.54 64.77,2.54 v67.31,5.08 | 44.45,2.54 E18.2
  Bottom 0.406: E17.1 78.74,3.81 68.58,3.81 v67.31,5.08 62.23,5.08 E18.9
BA1  (via drill 0.81)
  Top 0.406: E10.3 24.13,52.07 26.67,52.07 27.94,53.34 36.83,53.34 38.1,54.61 54.61,54.61 v55.88,55.88 66.04,48.26 97.79,48.26 101.6,44.45 106.68,44.45 106.68,50.8 104.14,53.34 104.14,55.88 106.68,58.42 116.84,58.42 U$5.BA1
  Bottom 0.406: E13.6 57.15,40.64 58.42,40.64 60.96,43.18 60.96,48.26 v55.88,55.88
BA(0)
  Top 0.406: U$5.BS1 116.84,13.97 109.22,13.97 97.79,2.54 85.09,2.54 E17.2
BA(1)
  Bottom 0.406: U$5.BP2 116.84,20.32 109.22,20.32 107.95,21.59 104.14,21.59 102.87,20.32 102.87,16.51 101.6,15.24 92.71,15.24 E17.10
BB  (via drill 0.81)
  Top 0.406: E19.5 26.67,3.81 38.1,3.81 v39.37,5.08
  Bottom 0.406: E17.3 82.55,2.54 62.23,2.54 58.42,7.62 57.15,8.89 54.61,8.89 52.07,6.35 E18.5 52.07,3.81 50.8,2.54 40.64,2.54 39.37,3.81 v39.37,5.08
BB(0)  (via drill 0.81)
  Top 0.406: U$5.BR1 116.84,16.51 110.49,16.51 101.6,7.62 v97.79,7.62
  Bottom 0.406: v97.79,7.62 90.17,7.62 E17.4
BB(1)
  Bottom 0.406: U$5.BU2 116.84,7.62 111.76,7.62 107.95,3.81 105.41,3.81 102.87,2.54 95.25,2.54 E17.6
BC1  (via drill 0.81)
  Top 0.406: U$5.BC1 117.15,51.76 116.84,52.07 110.49,52.07 107.95,49.53 107.95,44.45 106.68,43.18 100.33,43.18 96.52,46.99 v64.77,46.99 R14.1 | E16.9 53.34,26.67 53.34,27.94 54.61,29.21 57.15,29.21 63.5,22.86 v66.04,22.86
  Bottom 0.406: v66.04,22.86 66.04,27.94 62.23,31.75 62.23,34.29 64.77,36.83 v64.77,46.99
BN1
  Top 0.406: E15.12 22.86,31.75 49.53,31.75 52.07,34.29 60.96,34.29 64.77,30.48 104.14,30.48 111.76,22.86 116.84,22.86 117.17,23.19 U$5.BN1
  Bottom 0.406: E15.12 20.32,30.48 15.24,35.56 13.97,39.37 13.97,43.18 12.7,59.69 13.97,60.96 17.78,60.96 | 17.78,60.96 E10.2 | E10.6 27.94,59.69 26.67,60.96 17.78,60.96
BV2
  Bottom 0.406: E13.5 54.61,33.02 59.69,26.67 59.69,25.4 E16.6
CLOCK1  (via drill 0.81)
  Top 0.406: E15.11 24.13,30.48 31.75,30.48 33.02,29.21 49.53,29.21 52.07,31.75 60.96,31.75 64.77,27.94 v71.12,27.94 99.06,27.94 106.68,20.32 v106.68,17.78 | v62.23,127 60.96,128.27 53.34,128.27 E2.10
  Bottom 0.406: U$5.BS2 116.84,13.97 109.22,13.97 v106.68,17.78 | v71.12,27.94 66.04,31.75 66.04,34.29 67.31,36.83 68.58,48.26 62.23,53.34 62.23,58.42 68.58,67.31 68.58,91.44 64.77,107.95 64.77,113.03 62.23,118.11 v62.23,127
CLR_FLAG  (via drill 0.81)
  Top 0.406: E8.6 v35.56,82.55
  Bottom 0.406: E5.13 44.45,101.6 39.37,96.52 39.37,93.98 36.83,87.63 v35.56,82.55
ENABLE
  Top 0.406: E16.13 41.91,27.94 29.21,27.94 E15.9
FEED_HOLE
  Bottom 0.406: U$5.BM2 116.84,26.67 105.41,26.67 R11.1
FEED_SWITCH  (via drill 0.81)
  Top 0.406: U$5.BM1 117.17,26.34 116.84,26.67 109.22,26.67 104.14,31.75 73.66,31.75 71.12,34.29 63.5,34.29 60.96,36.83 v59.69,36.83 | E10.4 R2.1 26.67,54.61 36.83,54.61 38.1,55.88 53.34,55.88 54.61,57.15 v58.42,57.15
  Bottom 0.406: v58.42,57.15 59.69,53.34 62.23,48.26 62.23,41.91 v59.69,36.83
GND  (via drill 0.81)
  Top 0.813: C18.2 16.51,7.62 27.94,7.62 E19.7 36.83,5.08 38.1,6.35 40.64,6.35 41.91,7.62 54.61,7.62 E18.7 63.5,5.08 64.77,6.35 68.58,6.35 69.85,5.08 C14.2 78.74,7.62 92.71,7.62 E17.7 | C21.- v102.87,50.8 83.82,58.42 73.66,58.42 69.85,62.23 60.96,62.23 58.42,64.77 E9.7 54.61,67.31 39.37,67.31 C10.2 34.29,64.77 30.48,60.96 | C24.2 D2.A R5.1 69.85,80.01 C7.2 77.47,87.63 91.44,87.63 E7.7 | E3.7 C23.2 C2.2 39.37,121.92 57.15,121.92 | 57.15,121.92 E2.7 | C1.2 60.96,119.38 58.42,121.92 57.15,121.92 | v13.97,25.4 E15.2 | v102.87,5.08 107.95,10.16 116.84,10.16 U$5.BT1 | E15.7 53.34,21.59 E16.7 | C11.2 13.97,44.45 27.94,44.45 E12.7 31.75,40.64 38.1,40.64 | E8.9 24.13,78.74 17.78,78.74 16.51,77.47 13.97,77.47 C8.2 | 30.48,60.96 E10.7 | v60.96,73.66 C9.2 76.2,72.39 91.44,72.39 E11.7 | 44.45,97.79 39.37,97.79 C5.2 33.02,91.44 E6.7 | 44.45,97.79 54.61,97.79 E5.7 C4.2 74.93,110.49 83.82,110.49 E4.12 88.9,115.57 v100.33,115.57 | 44.45,97.79 E5.2 | 38.1,40.64 C13.2 | 57.15,40.64 38.1,40.64 | E13.7 57.15,40.64 | 30.48,60.96 16.51,60.96 C17.2 | C12.2 69.85,40.64 57.15,40.64
  Bottom 0.813: E3.7 26.67,102.87 11.43,102.87 | 11.43,102.87 C3.2 | 11.43,102.87 C6.2 | U$5.AC2 117.17,121.59 116.84,121.92 109.22,121.92 106.68,124.46 102.87,124.46 99.06,120.65 | U$5.BC2 117.17,51.74 116.84,52.07 104.14,52.07 v102.87,50.8 | C12.2 77.47,38.1 93.98,38.1 | 93.98,38.1 E14.7 | C21.- 96.52,38.1 93.98,38.1 | E8.7 E8.9 E6.7 | E13.7 57.15,34.29 59.69,29.21 C16.- E16.7 R10.1 | C18.2 C15.2 11.43,22.86 v13.97,25.4 | E15.7 27.94,24.13 20.32,24.13 E15.2 | E9.7 57.15,67.31 v60.96,73.66 58.42,77.47 R5.1 | C20.- 102.87,113.03 v100.33,115.57 100.33,116.84 99.06,120.65 | E2.7 R4.1 | E17.7 v102.87,5.08 | C17.2 C8.2 | 86.36,129.54 E1.12 | 86.36,129.54 93.98,129.54 96.52,127 99.06,120.65 | C1.2 72.39,123.19 72.39,128.27 73.66,129.54 86.36,129.54
INT_REQUEST  (via drill 0.81)
  Top 0.406: v105.41,97.79 69.85,97.79 67.31,95.25 67.31,90.17 64.77,87.63 62.23,87.63 58.42,88.9 35.56,88.9 34.29,87.63 19.05,87.63 E6.1
  Bottom 0.406: U$5.AL2 116.84,99.06 109.22,99.06 v105.41,97.79
IOB_IN_4  (via drill 0.81)
  Top 0.406: E7.1 82.55,81.28 95.25,81.28 101.6,87.63 v102.87,87.63
  Bottom 0.406: U$5.AP2 116.84,90.17 106.68,90.17 v102.87,87.63
IOB_IN_5  (via drill 0.81)
  Top 0.406: v105.41,80.01 102.87,80.01 100.33,77.47 100.33,71.12 95.25,66.04 82.55,66.04 E11.1
  Bottom 0.406: U$5.AS2 116.84,83.82 110.49,83.82 v105.41,80.01
IOB_IN_6
  Top 0.406: E11.10 91.44,74.93 93.98,74.93 96.52,77.47 96.52,81.28 100.33,85.09 104.14,85.09 105.41,86.36 116.84,86.36 U$5.AR1
IOB_IN_7  (via drill 0.81)
  Top 0.406: E7.10 90.17,91.44 100.33,91.44 v101.6,92.71
  Bottom 0.406: U$5.AN2 116.84,92.71 v101.6,92.71
IOB_IN_8
  Top 0.406: E11.4 88.9,67.31 95.25,67.31 99.06,71.12 99.06,80.01 100.33,81.28 105.41,81.28 109.22,83.82 116.84,83.82 U$5.AS1
IOB_IN_9
  Top 0.406: E7.4 88.9,82.55 95.25,82.55 102.87,90.17 115.57,90.17 U$5.AP1
IOB_IN_10  (via drill 0.81)
  Top 0.406: E11.13 85.09,73.66 93.98,73.66 97.79,77.47 97.79,81.28 100.33,83.82 v105.41,83.82
  Bottom 0.406: U$5.AR2 116.84,86.36 109.22,86.36 v105.41,83.82
IOB_IN_11
  Top 0.406: E7.13 83.82,90.17 101.6,90.17 104.14,92.71 116.84,92.71 U$5.AN1
IOP1  (via drill 0.81)
  Top 0.406: v102.87,76.2 102.87,72.39 95.25,64.77 77.47,64.77 76.2,66.04 66.04,66.04 v62.23,69.85 | E9.1 44.45,62.23 v52.07,62.23
  Bottom 0.406: U$5.AU2 116.84,77.47 104.14,77.47 v102.87,76.2 | v52.07,62.23 57.15,62.23 59.69,64.77 59.69,67.31 v62.23,69.85
IOP2  (via drill 0.81)
  Top 0.406: v105.41,74.93 105.41,73.66 95.25,63.5 77.47,63.5 76.2,64.77 63.5,64.77 58.42,69.85 49.53,69.85 E9.12
  Bottom 0.406: U$5.AV2 116.84,73.66 106.68,73.66 v105.41,74.93
IOP4  (via drill 0.81)
  Top 0.406: U$5.BK1 117.14,32.72 116.84,33.02 v106.68,33.02 | E9.5 53.34,63.5 57.15,63.5 59.69,60.96 68.58,60.96 v69.85,59.69
  Bottom 0.406: v106.68,33.02 99.06,29.21 85.09,29.21 74.93,34.29 73.66,34.29 72.39,35.56 72.39,48.26 68.58,54.61 68.58,58.42 v69.85,59.69
IOT_011  (via drill 0.81)
  Top 0.406: v102.87,100.33 69.85,100.33 63.5,93.98 v63.5,90.17 58.42,91.44 35.56,91.44 34.29,90.17 29.21,90.17 E6.6 | E13.12 v52.07,49.53
  Bottom 0.406: U$5.AM2 116.84,96.52 109.22,96.52 106.68,95.25 104.14,95.25 102.87,96.52 v102.87,100.33 | v63.5,90.17 64.77,69.85 59.69,62.23 54.61,59.69 53.34,58.42 50.8,54.61 50.8,50.8 v52.07,49.53
MB3(0)
  Top 0.406: E14.12 E14.11
  Bottom 0.406: U$5.BD2 117.14,48.56 116.84,48.26 104.14,48.26 95.25,40.64 88.9,40.64 E14.11
MB4(0)
  Top 0.406: E14.3 E14.4
  Bottom 0.406: E14.4 88.9,33.02 95.25,33.02 109.22,45.72 116.84,45.72 117.17,45.39 U$5.BE2
MB5(0)
  Top 0.406: U$5.BE1 117.17,45.39 116.84,45.72 111.76,45.72 105.41,39.37 92.71,39.37 E14.5
MB6(0)
  Bottom 0.406: E14.2 85.09,31.75 95.25,31.75 106.68,41.91 116.84,41.91 117.12,42.19 U$5.BF2
MB7(0)
  Top 0.406: U$5.BF1 117.12,42.19 116.84,41.91 109.22,41.91 105.41,38.1 93.98,38.1 E14.6
MB8(1)
  Bottom 0.406: E14.1 85.09,30.48 96.52,30.48 106.68,39.37 116.84,39.37 117.17,39.04 U$5.BH2
N$1
  Top 0.406: D1.C 15.24,123.19 17.78,120.65 E3.13
N$2
  Bottom 0.406: E7.2 76.2,91.44 74.93,100.33 74.93,106.68 78.74,110.49 E4.15
N$3
  Bottom 0.406: E11.2 76.2,76.2 76.2,78.74 72.39,82.55 72.39,92.71 73.66,93.98 73.66,107.95 76.2,110.49 E4.16
N$4
  Bottom 0.406: R1.1 D1.A 21.59,121.92 24.13,119.38 C22.+
N$5
  Top 0.406: E13.9 55.88,46.99 58.42,46.99 60.96,44.45 76.2,44.45 78.74,40.64 91.44,40.64 E14.8
N$6  (via drill 0.81)
  Top 0.406: E2.11 48.26,128.27 35.56,128.27 v34.29,127
  Bottom 0.406: v34.29,127 33.02,128.27 10.16,128.27 7.62,125.73 7.62,91.44 12.7,86.36 12.7,80.01 E8.1
N$8
  Bottom 0.406: 44.45,67.31 E9.2 | 44.45,67.31 E9.13 | 44.45,67.31 48.26,67.31 49.53,66.04 E9.4 49.53,49.53 50.8,48.26 55.88,48.26 57.15,46.99 E13.8
N$9
  Bottom 0.406: E4.9 97.79,105.41 97.79,97.79 95.25,88.9 95.25,80.01 E11.8
N$10
  Bottom 0.406: E4.10 91.44,111.76 95.25,107.95 95.25,101.6 E7.9
N$11  (via drill 0.81)
  Top 0.406: E11.5 90.17,68.58 95.25,68.58 97.79,71.12 v97.79,72.39
  Bottom 0.406: v97.79,72.39 100.33,82.55 100.33,107.95 101.6,109.22 101.6,111.76 99.06,114.3 99.06,115.57 E1.9
N$12  (via drill 0.81)
  Top 0.406: E7.5 90.17,83.82 95.25,83.82 97.79,86.36 v97.79,87.63
  Bottom 0.406: v97.79,87.63 99.06,97.79 99.06,107.95 100.33,109.22 100.33,111.76 97.79,114.3 97.79,115.57 95.25,121.92 E1.10
N$13  (via drill 0.81)
  Top 0.406: v72.39,80.01 81.28,80.01 E11.12
  Bottom 0.406: E1.15 77.47,128.27 74.93,128.27 73.66,127 73.66,123.19 71.12,118.11 67.31,115.57 67.31,106.68 69.85,101.6 71.12,90.17 71.12,81.28 v72.39,80.01
N$14  (via drill 0.81)
  Top 0.406: v72.39,95.25 81.28,95.25 E7.12
  Bottom 0.406: E1.16 76.2,125.73 73.66,119.38 73.66,110.49 72.39,109.22 v72.39,95.25
N$16
  Bottom 0.406: E2.12 48.26,128.27 55.88,128.27 E2.8
N$17
  Bottom 0.406: R12.1 Q1.2 Q2.3 E17.13
N$18
  Bottom 0.406: Q1.3 R13.1
N$19
  Top 0.406: Q2.1 Q1.1
  Bottom 0.406: R10.2 80.01,20.32 Q2.1
N$20
  Top 0.406: R9.2 69.85,19.05 71.12,20.32 Q2.2
N$21  (via drill 0.81)
  Top 0.406: R16.1 29.21,124.46 31.75,121.92 31.75,113.03 30.48,111.76 22.86,111.76 E3.2 E3.1 13.97,105.41 10.16,105.41 7.62,102.87 7.62,20.32 10.16,17.78 20.32,17.78 E19.10 27.94,10.16 35.56,10.16 v36.83,11.43 | v35.56,6.35 36.83,7.62 39.37,7.62 40.64,8.89 62.23,8.89 R15.1
  Bottom 0.406: E3.1 E3.2 | E17.12 85.09,11.43 82.55,8.89 74.93,8.89 73.66,10.16 67.31,10.16 R15.1 | v36.83,11.43 v35.56,6.35
N$22
  Bottom 0.406: R9.1 77.47,24.13 C16.+ 78.74,26.67 85.09,21.59 R11.2
N$24  (via drill 0.81)
  Top 0.406: v40.64,16.51 39.37,15.24 31.75,15.24 v30.48,16.51
  Bottom 0.406: E16.5 52.07,19.05 50.8,20.32 41.91,20.32 40.64,19.05 v40.64,16.51 | E19.6 33.02,11.43 33.02,13.97 v30.48,16.51
N$25
  Top 0.406: E16.3 E16.4
N$26  (via drill 0.81)
  Top 0.406: v38.1,35.56 R3.1
  Bottom 0.406: E16.11 49.53,24.13 48.26,22.86 41.91,22.86 39.37,25.4 v38.1,35.56
N$27
  Top 0.406: E17.9 90.17,15.24 74.93,15.24 73.66,13.97 62.23,13.97 59.69,16.51 59.69,19.05 55.88,22.86 29.21,22.86 E15.6
N$28  (via drill 0.81)
  Top 0.406: v33.02,59.69 34.29,58.42 38.1,58.42 v39.37,59.69
  Bottom 0.406: E15.10 22.86,31.75 22.86,35.56 25.4,38.1 29.21,38.1 33.02,41.91 33.02,46.99 35.56,50.8 39.37,54.61 v39.37,59.69 | E10.12 22.86,63.5 29.21,63.5 v33.02,59.69
N$29
  Top 0.406: R6.1 E9.8
  Bottom 0.406: C19.2 45.72,78.74 46.99,77.47 R6.1 C24.1
N$30
  Top 0.406: D2.C R5.2 45.72,80.01 C19.1
  Bottom 0.406: E2.2 59.69,104.14 59.69,95.25 50.8,86.36 D2.C
N$32
  Bottom 0.406: E13.2 E13.3
N$33
  Bottom 0.406: E10.8 E8.5
N$34
  Top 0.406: E6.11 27.94,104.14 33.02,104.14 35.56,106.68 39.37,106.68 40.64,107.95 40.64,114.3 43.18,116.84 46.99,116.84 E2.4
  Bottom 0.406: E3.8 33.02,119.38 35.56,121.92 48.26,121.92 49.53,120.65 E2.4
N$35  (via drill 0.81)
  Top 0.406: E8.11 26.67,86.36 34.29,86.36 35.56,87.63 55.88,87.63 v57.15,86.36
  Bottom 0.406: 54.61,124.46 E2.6 | 54.61,124.46 E2.9 | 54.61,124.46 58.42,121.92 59.69,120.65 59.69,107.95 62.23,104.14 62.23,91.44 v57.15,86.36
N$36
  Top 0.406: E12.10 E12.9 | E12.12 E12.13 17.78,53.34 10.16,62.23 10.16,67.31 13.97,71.12 19.05,71.12 E8.4
  Bottom 0.406: E12.12 20.32,48.26 21.59,46.99 24.13,46.99 25.4,48.26 E12.10
N$37
  Bottom 0.406: E3.11 17.78,119.38 C22.- 13.97,119.38 8.89,115.57 8.89,97.79 10.16,96.52 11.43,96.52 12.7,97.79 12.7,99.06 13.97,100.33 16.51,100.33 E6.13
N$38
  Top 0.406: E6.12 17.78,101.6 11.43,101.6 10.16,100.33 10.16,90.17 E8.12
N$39
  Top 0.406: E12.2 E12.1 | E12.4 E12.5
  Bottom 0.406: R3.2 E12.2 17.78,43.18 19.05,44.45 21.59,44.45 22.86,43.18 E12.4
N$40
  Top 0.406: E19.9 21.59,19.05 10.16,19.05 8.89,20.32 8.89,76.2 11.43,78.74 13.97,78.74 E8.13
  Bottom 0.406: E19.11 22.86,11.43 24.13,10.16 26.67,10.16 27.94,11.43 E19.9
N$41
  Bottom 0.406: E19.12 20.32,11.43 22.86,8.89 27.94,8.89 30.48,11.43 E19.8
OFFLINE  (via drill 0.81)
  Top 0.406: C23.1 R4.2 52.07,116.84 | 52.07,116.84 E2.5 | v66.04,116.84 52.07,116.84 | U$5.BU1 116.84,7.62 107.95,7.62 v106.68,6.35 | v100.33,10.16 102.87,12.7 102.87,21.59 99.06,25.4 v96.52,25.4
  Bottom 0.406: R4.2 C23.1 | v100.33,10.16 v106.68,6.35 | v96.52,25.4 90.17,27.94 85.09,27.94 74.93,33.02 72.39,33.02 71.12,34.29 71.12,48.26 67.31,54.61 67.31,59.69 69.85,66.04 69.85,90.17 66.04,107.95 v66.04,116.84
OUT_OF_TAPE  (via drill 0.81)
  Top 0.406: E6.10 29.21,102.87 34.29,102.87 36.83,105.41 41.91,105.41 45.72,109.22 46.99,109.22 50.8,113.03 60.96,113.03 v63.5,110.49
  Bottom 0.406: U$5.BL2 116.84,29.21 105.41,29.21 97.79,21.59 95.25,21.59 88.9,25.4 83.82,25.4 80.01,27.94 76.2,27.94 74.93,26.67 74.93,22.86 73.66,21.59 72.39,21.59 71.12,22.86 71.12,25.4 64.77,31.75 64.77,34.29 66.04,36.83 66.04,48.26 60.96,53.34 60.96,58.42 67.31,68.58 67.31,90.17 64.77,96.52 64.77,104.14 63.5,107.95 v63.5,110.49
PWR
  Bottom 0.406: U$5.BR2 116.84,16.51 110.49,16.51 106.68,20.32 105.41,20.32 104.14,19.05 104.14,15.24 102.87,13.97 96.52,13.97 E17.8
RD_HOLE_1  (via drill 0.81)
  Top 0.406: E1.2 82.55,123.19 100.33,123.19 101.6,121.92 v104.14,121.92
  Bottom 0.406: U$5.AD2 117.14,118.42 116.84,118.11 107.95,118.11 v104.14,121.92
RD_HOLE_2
  Top 0.406: E1.3 83.82,121.92 99.06,121.92 101.6,119.38 106.68,119.38 107.95,118.11 116.84,118.11 U$5.AD1
RD_HOLE_3  (via drill 0.81)
  Top 0.406: E1.6 91.44,116.84 v104.14,116.84
  Bottom 0.406: U$5.AE2 117.17,115.24 116.84,115.57 105.41,115.57 v104.14,116.84
RD_HOLE_4
  Top 0.406: E1.7 92.71,120.65 97.79,120.65 100.33,118.11 105.41,118.11 107.95,115.57 115.57,115.57 U$5.AE1
RD_HOLE_5  (via drill 0.81)
  Top 0.406: v105.41,105.41 102.87,102.87 90.17,102.87 88.9,104.14 E4.6
  Bottom 0.406: U$5.AH2 116.84,109.22 109.22,109.22 v105.41,105.41
RD_HOLE_6
  Top 0.406: U$5.AH1 116.84,109.22 101.6,109.22 96.52,104.14 92.71,104.14 E4.7
RD_HOLE_7  (via drill 0.81)
  Top 0.406: E4.2 82.55,109.22 86.36,109.22 88.9,111.76 96.52,111.76 99.06,114.3 v104.14,114.3
  Bottom 0.406: U$5.AF2 117.12,112.04 116.84,111.76 106.68,111.76 v104.14,114.3
RD_HOLE_8
  Top 0.406: E4.3 83.82,107.95 86.36,107.95 88.9,110.49 96.52,110.49 97.79,111.76 116.84,111.76 U$5.AF1
RDR_FLAG
  Bottom 0.406: 25.4,93.98 19.05,93.98 17.78,92.71 E6.2 E6.3 | 25.4,93.98 E6.5 | 25.4,93.98 26.67,93.98 31.75,97.79 34.29,110.49 35.56,114.3 46.99,114.3 53.34,107.95 E5.9
RDR_RUN
  Bottom 0.406: E5.5 E5.12
SHIFT  (via drill 0.81)
  Top 0.406: U$5.BJ1 116.84,35.56 106.68,35.56 104.14,33.02 73.66,33.02 71.12,35.56 64.77,35.56 v62.23,38.1
  Bottom 0.406: E18.3 E18.11 50.8,13.97 66.04,13.97 67.31,15.24 67.31,19.05 64.77,21.59 64.77,26.67 60.96,30.48 60.96,34.29 62.23,35.56 v62.23,38.1
SKIP  (via drill 0.81)
  Top 0.406: v105.41,100.33 104.14,99.06 69.85,99.06 66.04,95.25 66.04,90.17 64.77,88.9 62.23,88.9 58.42,90.17 35.56,90.17 34.29,88.9 25.4,88.9 E6.4
  Bottom 0.406: U$5.AK2 116.84,102.87 111.76,102.87 v105.41,100.33
STOP_COMPLETE  (via drill 0.81)
  Top 0.406: v34.29,30.48 49.53,30.48 52.07,33.02 60.96,33.02 64.77,29.21 102.87,29.21 v106.68,25.4
  Bottom 0.406: E10.13 17.78,67.31 16.51,68.58 13.97,68.58 12.7,67.31 12.7,64.77 8.89,60.96 8.89,40.64 12.7,36.83 12.7,31.75 11.43,30.48 10.16,30.48 7.62,27.94 7.62,6.35 11.43,2.54 31.75,2.54 33.02,3.81 33.02,8.89 34.29,11.43 v34.29,30.48 | U$5.BN2 116.84,22.86 110.49,22.86 v106.68,25.4
STOP_DELAY  (via drill 0.81)
  Top 0.406: U$5.BV1 116.84,3.81 106.68,3.81 104.14,1.27 12.7,1.27 10.16,3.81 10.16,13.97 11.43,15.24 v20.32,15.24
  Bottom 0.406: v20.32,15.24 E15.3

### Text on the board
Top: + | + | + | +
Bottom: CONTROL M7050D | READER | S